# EAGLE schematic Visually impaired v6 panel - v1 (EAGLE 6.5.0)

## Sheet 1 of 4
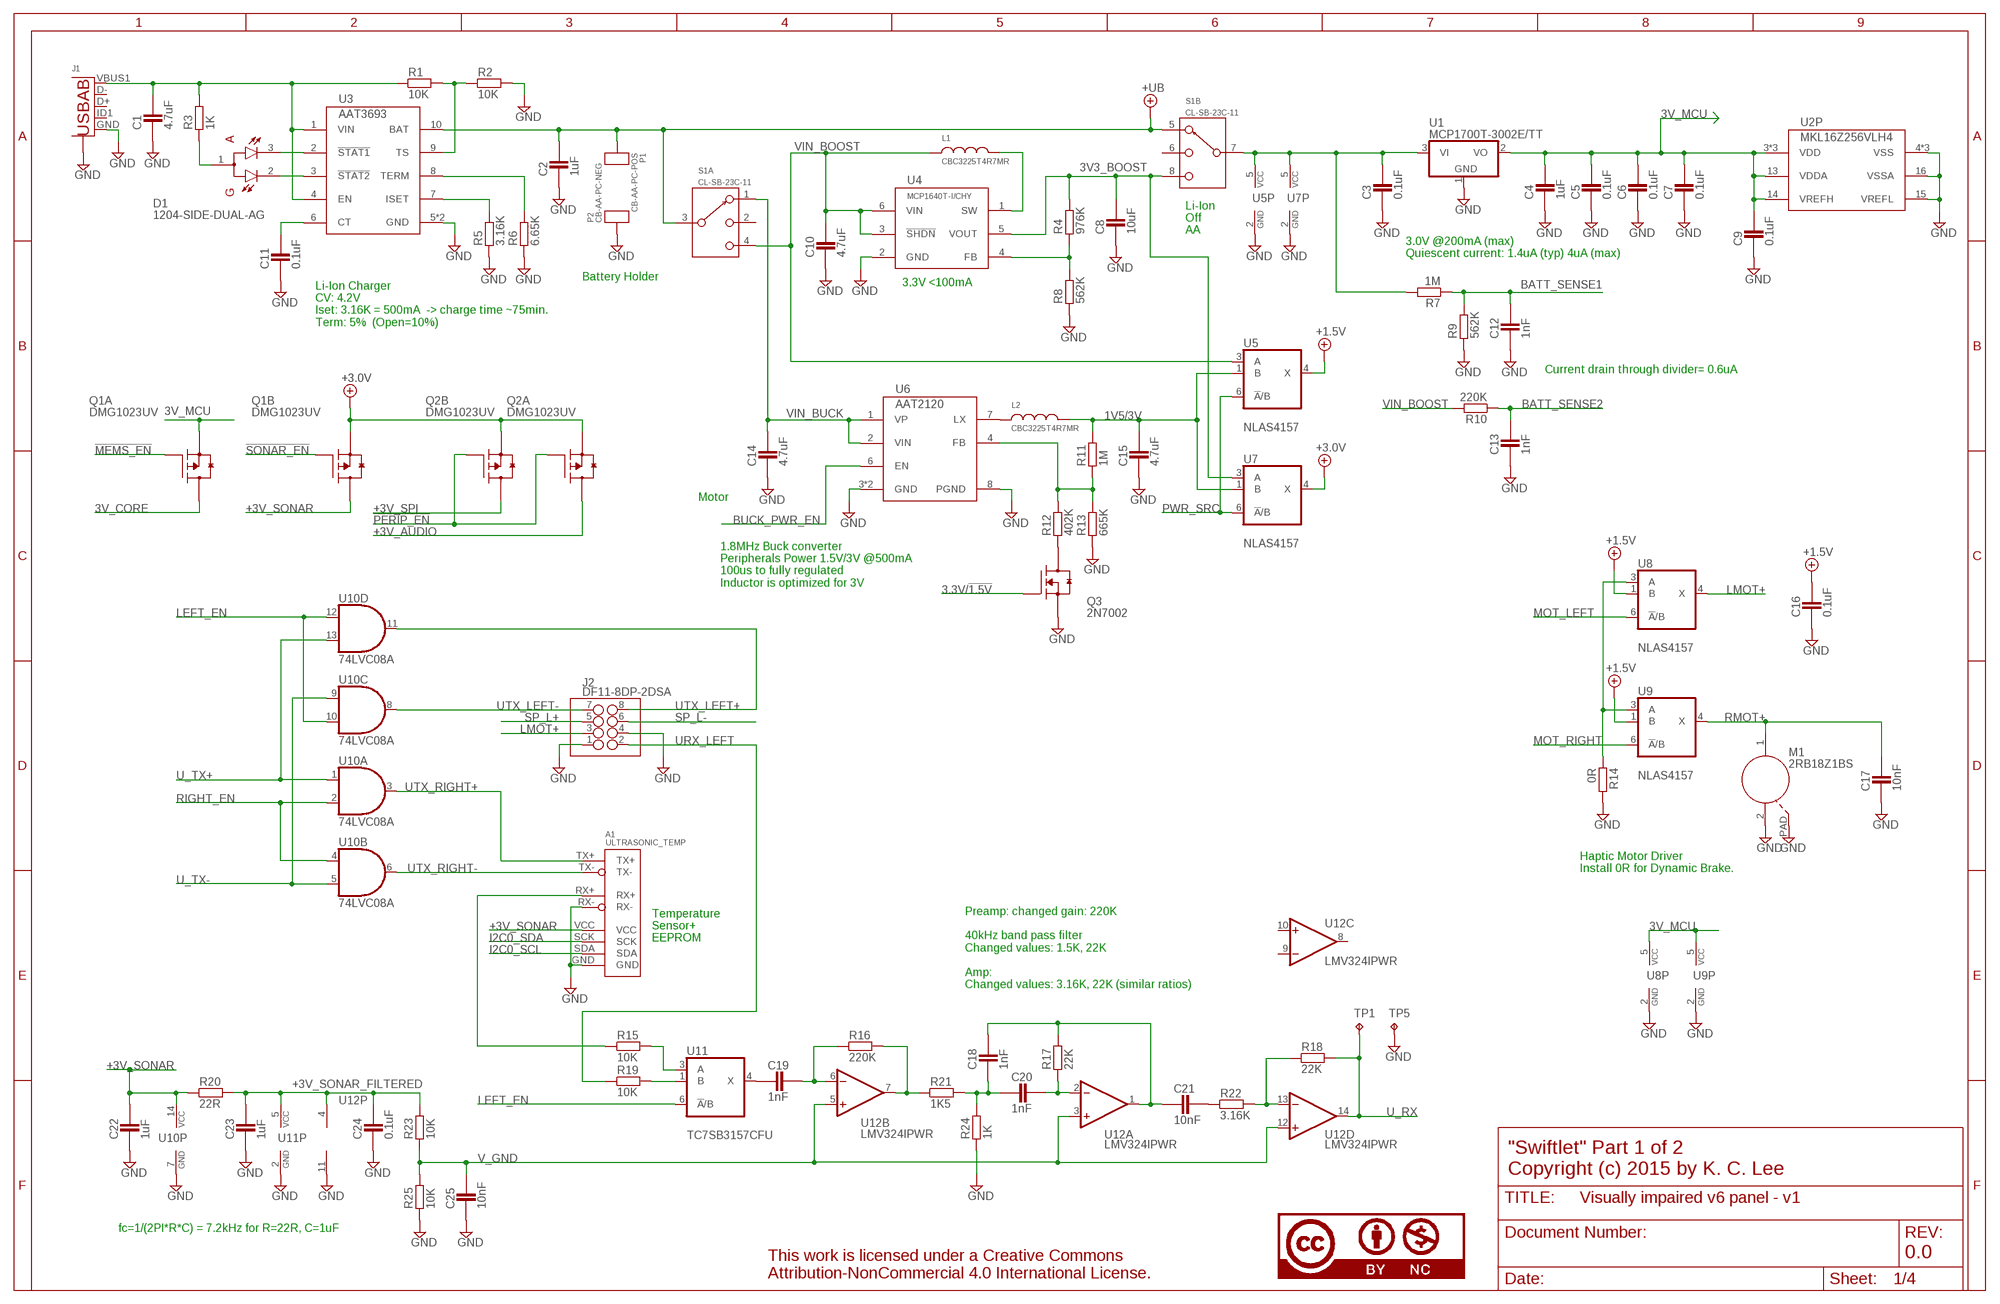
[diagram p0: schematic, sheet 1]

### Parts
A1  ULTRASONIC_TEMP  ULTRASONIC_ASM  [ULTRASONIC_ASM]
C1  4.7uF  CAPACITOR_0603  [CAPC1608X92N]
C2  1uF  CAPACITOR_0402  [CAPC1005X60N]
C3  0.1uF  CAPACITOR_0402  [CAPC1005X60N]
C4  1uF  CAPACITOR_0603  [CAPC1608X92N]
C5  0.1uF  CAPACITOR_0402  [CAPC1005X60N]
C6  0.1uF  CAPACITOR_0402  [CAPC1005X60N]
C7  0.1uF  CAPACITOR_0402  [CAPC1005X60N]
C8  10uF  CAPACITOR_0805N  [CAP2012X70N]
C9  0.1uF  CAPACITOR_0402  [CAPC1005X60N]
C10  4.7uF  CAPACITOR_0603  [CAPC1608X92N]
C11  0.1uF  CAPACITOR_0402  [CAPC1005X60N]
C12  1nF  CAPACITOR_0402  [CAPC1005X60N]
C13  1nF  CAPACITOR_0402  [CAPC1005X60N]
C14  4.7uF  CAPACITOR_0603  [CAPC1608X92N]
C15  4.7uF  CAPACITOR_0603  [CAPC1608X92N]
C16  0.1uF  CAPACITOR_0402  [CAPC1005X60N]
C17  10nF  CAPACITOR_0402  [CAPC1005X60N]
C18  1nF  CAPACITOR_0402  [CAPC1005X60N]
C19  1nF  CAPACITOR_0402  [CAPC1005X60N]
C20  1nF  CAPACITOR_0402  [CAPC1005X60N]
C21  10nF  CAPACITOR_0402  [CAPC1005X60N]
C22  1uF  CAPACITOR_0402  [CAPC1005X60N]
C23  1uF  CAPACITOR_0402  [CAPC1005X60N]
C24  0.1uF  CAPACITOR_0402  [CAPC1005X60N]
C25  10nF  CAPACITOR_0402  [CAPC1005X60N]
D1  1204-SIDE-DUAL-AG  [LED_1204]
J1  USB-ABBG  [USB-AB-MICRO-SMD_V03_SF]
J2  DF11-8DP-2DSA  [DF11-8DP-2DSA]
L1  CBC3225T4R7MR  INDUCTOR_1210  [INDC3225X135N]
L2  CBC3225T4R7MR  INDUCTOR_1210  [INDC3225X135N]
M1  2RB18Z1BS  [2RB18Z1BS]
P1  CB-AA-PC-POS  [CB-AA-PC-POS]
P2  CB-AA-PC-NEG  [CB-AA-PC-NEG]
Q1  DMG1023UV  MOSFET-P-DUALDMP3085LSD  [SOT563]
Q2  DMG1023UV  MOSFET-P-DUALDMP3085LSD  [SOT563]
Q3  2N7002  MOSFET-NCH_SOT-23  [SOT95P280X135-3N]
R1  10K  RESISTOR_0402  [RESC1005X40AN]
R2  10K  RESISTOR_0402  [RESC1005X40AN]
R3  1K  RESISTOR_0402  [RESC1005X40AN]
R4  976K  RESISTOR_0402  [RESC1005X40AN]
R5  3.16K  RESISTOR_0402  [RESC1005X40AN]
R6  6.65K  RESISTOR_0402  [RESC1005X40AN]
R7  1M  RESISTOR_0402  [RESC1005X40AN]
R8  562K  RESISTOR_0402  [RESC1005X40AN]
R9  562K  RESISTOR_0402  [RESC1005X40AN]
R10  220K  RESISTOR_0402  [RESC1005X40AN]
R11  1M  RESISTOR_0402  [RESC1005X40AN]
R12  402K  RESISTOR_0402  [RESC1005X40AN]
R13  665K  RESISTOR_0402  [RESC1005X40AN]
R14  0R  RESISTOR_0402  [RESC1005X40AN]
R15  10K  RESISTOR_0402  [RESC1005X40AN]
R16  220K  RESISTOR_0402  [RESC1005X40AN]
R17  22K  RESISTOR_0402  [RESC1005X40AN]
R18  22K  RESISTOR_0402  [RESC1005X40AN]
R19  10K  RESISTOR_0402  [RESC1005X40AN]
R20  22R  RESISTOR_0402  [RESC1005X40AN]
R21  1K5  RESISTOR_0402  [RESC1005X40AN]
R22  3.16K  RESISTOR_0402  [RESC1005X40AN]
R23  10K  RESISTOR_0402  [RESC1005X40AN]
R24  1K  RESISTOR_0402  [RESC1005X40AN]
R25  10K  RESISTOR_0402  [RESC1005X40AN]
S1  CL-SB-23C-11  JS203011AQNAQN  [SW-JS203011AQN]
TP1  TPTP06SQ  [TP06SQ]
TP5  TPTP06SQ  [TP06SQ]
U1  MCP1700T-3002E/TT  MCP1700/TT  [SOT95P280X135-3N]
U2  MKL16Z256VLH4  MKL16Z_LH4  [LQFP64]
U3  AAT3693  [TDFN-10]
U4  MCP1640T-I/CHY  BOOST-MCP1624T-I/CHY  [SOT26]
U5  NLAS4157  741G3157DCKR  [DCK_R-PDSO-G6]
U6  AAT2120  [STDFN22-8]
U7  NLAS4157  741G3157DCKR  [DCK_R-PDSO-G6]
U8  NLAS4157  741G3157DCKR  [DCK_R-PDSO-G6]
U9  NLAS4157  741G3157DCKR  [DCK_R-PDSO-G6]
U10  74LVC08A  7408DB  [TSSOP14]
U11  TC7SB3157CFU  741G3157DCKR  [DCK_R-PDSO-G6]
U12  LMV324IPWR  QUAD_OPAMPPW  [TSSOP14]
U$1  CC100%  [CC-100]

### Nets
1V5/3V: C15.2 L2.2 R11.2 U5.1(B) U7.1(B)
3.3V/!1.5V: Q3.1(G) ; also sheet 2
3V3_BOOST: C8.2 R4.2 S1.8 U4.5(VOUT) U7.3(A)
3V_CORE: Q1.P$6(A:D) ; also sheet 2
3V_MCU: C4.2 C5.2 C6.2 C7.2 C9.2 Q1.P$1(A:S) U1.2(VO) U2.3(P:VDD) U2.13(P:VDDA) U2.14(P:VREFH) U2.30(P:VDD) U2.48(P:VDD) U8.5(VCC) U9.5(VCC) ; also sheet 2
!MEMS_EN: Q1.P$2(A:G) ; also sheet 2
!PERIP_EN: Q2.P$2(A:G) Q2.P$5(B:G) ; also sheet 2
!SONAR_EN: Q1.P$5(B:G) ; also sheet 2
+1.5V: C16.2 U5.4(X) U8.1(B) U9.1(B)
+3.0V: Q1.P$4(B:S) Q2.P$1(A:S) Q2.P$4(B:S) U7.4(X) ; also sheet 2
+3V_AUDIO: Q2.P$6(A:D) ; also sheet 2
+3V_SONAR: A1.VCC C22.2 Q1.P$3(B:D) R20.1 U10.14(P:VCC)
+3V_SONAR_FILTERED: C23.2 C24.2 R20.2 R23.2 U11.5(VCC) U12.4(P:V+)
+3V_SPI: Q2.P$3(B:D) ; also sheet 2
+UB: C2.2 P1.1(P) S1.3(A:S) S1.5 U3.10(BAT)
BATT_SENSE1: C12.2 R7.1 R9.2 ; also sheet 2
BATT_SENSE2: C13.2 R10.1 ; also sheet 2
BUCK_PWR_EN: U6.6(EN) ; also sheet 2
GND: A1.GND A1.RX- C1.1 C2.1 C3.1 C4.1 C5.1 C6.1 C7.1 C8.1 C9.1 C10.1 C11.1 C12.1 C13.1 C14.1 C15.1 C16.1 C17.1 C22.1 C23.1 C24.1 C25.1 J1.GND J1.S1(S) J1.S2(S) J1.S3(S) J1.S4(S) J2.1 J2.4 M1.2 M1.PAD P2.1(P) P2.2(P) Q3.2(S) R2.2 R5.1 R6.1 R8.1 R9.1 R13.1 R14.2 R24.1 R25.1 TP5.TP U1.1(GND) U2.4(P:VSS) U2.15(P:VREFL) U2.16(P:VSSA) U2.31(P:VSS) U2.47(P:VSS) U3.5(GND) U3.EP(GND) U4.2(GND) U5.2(GND) U6.3(GND) U6.8(PGND) U6.PAD(GND) U7.2(GND) U8.2(GND) U9.2(GND) U10.7(P:GND) U11.2(GND) U12.11(P:V-) ; also sheet 2,3,4
I2C0_SCL: A1.SDA ; also sheet 2
I2C0_SDA: A1.SCK ; also sheet 2
LEFT_EN: U10.10(C:I1) U10.12(D:I0) U11.6(!A!/B) ; also sheet 2
LMOT+: J2.3 U8.4(X)
MOT_LEFT: U8.6(!A!/B) ; also sheet 2
MOT_RIGHT: U9.6(!A!/B) ; also sheet 2
N$1: A1.RX+ R15.1
N$3: R14.1 U8.3(A) U9.3(A)
N$4: L1.2 U4.1(SW)
N$5: C11.2 U3.6(CT)
N$6: R5.2 U3.7(ISET)
N$7: R6.2 U3.8(TERM)
N$8: D1.1(A) R3.1
N$9: D1.3(C1) U3.2(!STAT1)
N$10: D1.2(C2) U3.3(!STAT2)
N$11: C1.2 J1.VBUS1(VBUS) R1.1 R3.2 U3.1(VIN) U3.4(EN)
N$12: R1.2 R2.1 U3.9(TS)
N$17: C21.2 R22.1
N$18: R19.2 U11.1(B)
N$19: R18.1 R22.2 U12.13(D:-IN)
N$20: C19.2 R16.1 U12.6(B:-IN)
N$21: R16.2 R21.1 U12.7(B:OUT)
N$22: C18.1 C20.1 R21.2 R24.2
N$23: C20.2 R17.1 U12.2(A:-IN)
N$24: R15.2 U11.3(A)
N$29: C19.1 U11.4(X)
N$32: R4.1 R8.2 U4.4(FB)
N$36: L2.1 U6.7(LX)
N$39: R11.1 R12.2 R13.2 U6.4(FB)
N$42: Q3.3(D) R12.1
PWR_SRC: U5.6(!A!/B) U7.6(!A!/B) ; also sheet 2
RIGHT_EN: U10.2(A:I1) U10.4(B:I0) ; also sheet 2
RMOT+: C17.2 M1.1 U9.4(X)
SP_L+: J2.5 ; also sheet 2,4
SP_L-: J2.6 ; also sheet 2,4
U_RX: R18.2 TP1.TP U12.14(D:OUT) ; also sheet 2
U_RX__: C18.2 C21.1 R17.2 U12.1(A:OUT)
U_TX+: U10.1(A:I0) U10.13(D:I1) ; also sheet 2
U_TX-: U10.5(B:I1) U10.9(C:I0) ; also sheet 2
URX_LEFT: J2.2 R19.1
UTX_LEFT+: J2.8 U10.11(D:O)
UTX_LEFT-: J2.7 U10.8(C:O)
UTX_RIGHT+: A1.TX+ U10.3(A:O)
UTX_RIGHT-: A1.TX- U10.6(B:O)
V_GND: C25.2 R23.1 R25.2 U12.3(A:+IN) U12.5(B:+IN) U12.12(D:+IN)
VIN_BOOST: C10.2 L1.1 R10.2 S1.4 U4.3(!SHDN) U4.6(VIN) U5.3(A)
VIN_BUCK: C14.2 S1.1 U6.1(VP) U6.2(VIN)
VIN_MCU: C3.2 R7.2 S1.7(B:S) U1.3(VI) U5.5(VCC) U7.5(VCC)
Unconnected: J1.D+ J1.D- J1.ID1(USBID) S1.2 S1.6 U12.8(C:OUT) U12.9(C:-IN) U12.10(C:+IN)

### Notes on the sheet
- Li-Ion
  Off
  AA
- 3.0V @200mA (max)
  Quiescent current: 1.4uA (typ) 4uA (max)
- Battery Holder
- 3.3V <100mA
- Li-Ion Charger
  CV: 4.2V
  Iset: 3.16K = 500mA  -> charge time ~75min.
  Term: 5%  (Open=10%)
- Current drain through divider= 0.6uA
- Motor
- 1.8MHz Buck converter
  Peripherals Power 1.5V/3V @500mA
  100us to fully regulated
  Inductor is optimized for 3V
- Haptic Motor Driver
  Install 0R for Dynamic Brake.
- Temperature 
  Sensor+ 
  EEPROM
- Preamp: changed gain: 220K
  
  40kHz band pass filter
  Changed values: 1.5K, 22K
  
  Amp:
  Changed values: 3.16K, 22K (similar ratios)
- "Swiftlet" Part 1 of 2
  Copyright (c) 2015 by K. C. Lee
- fc=1/(2PI*R*C) = 7.2kHz for R=22R, C=1uF
- 0.0

## Sheet 2 of 4
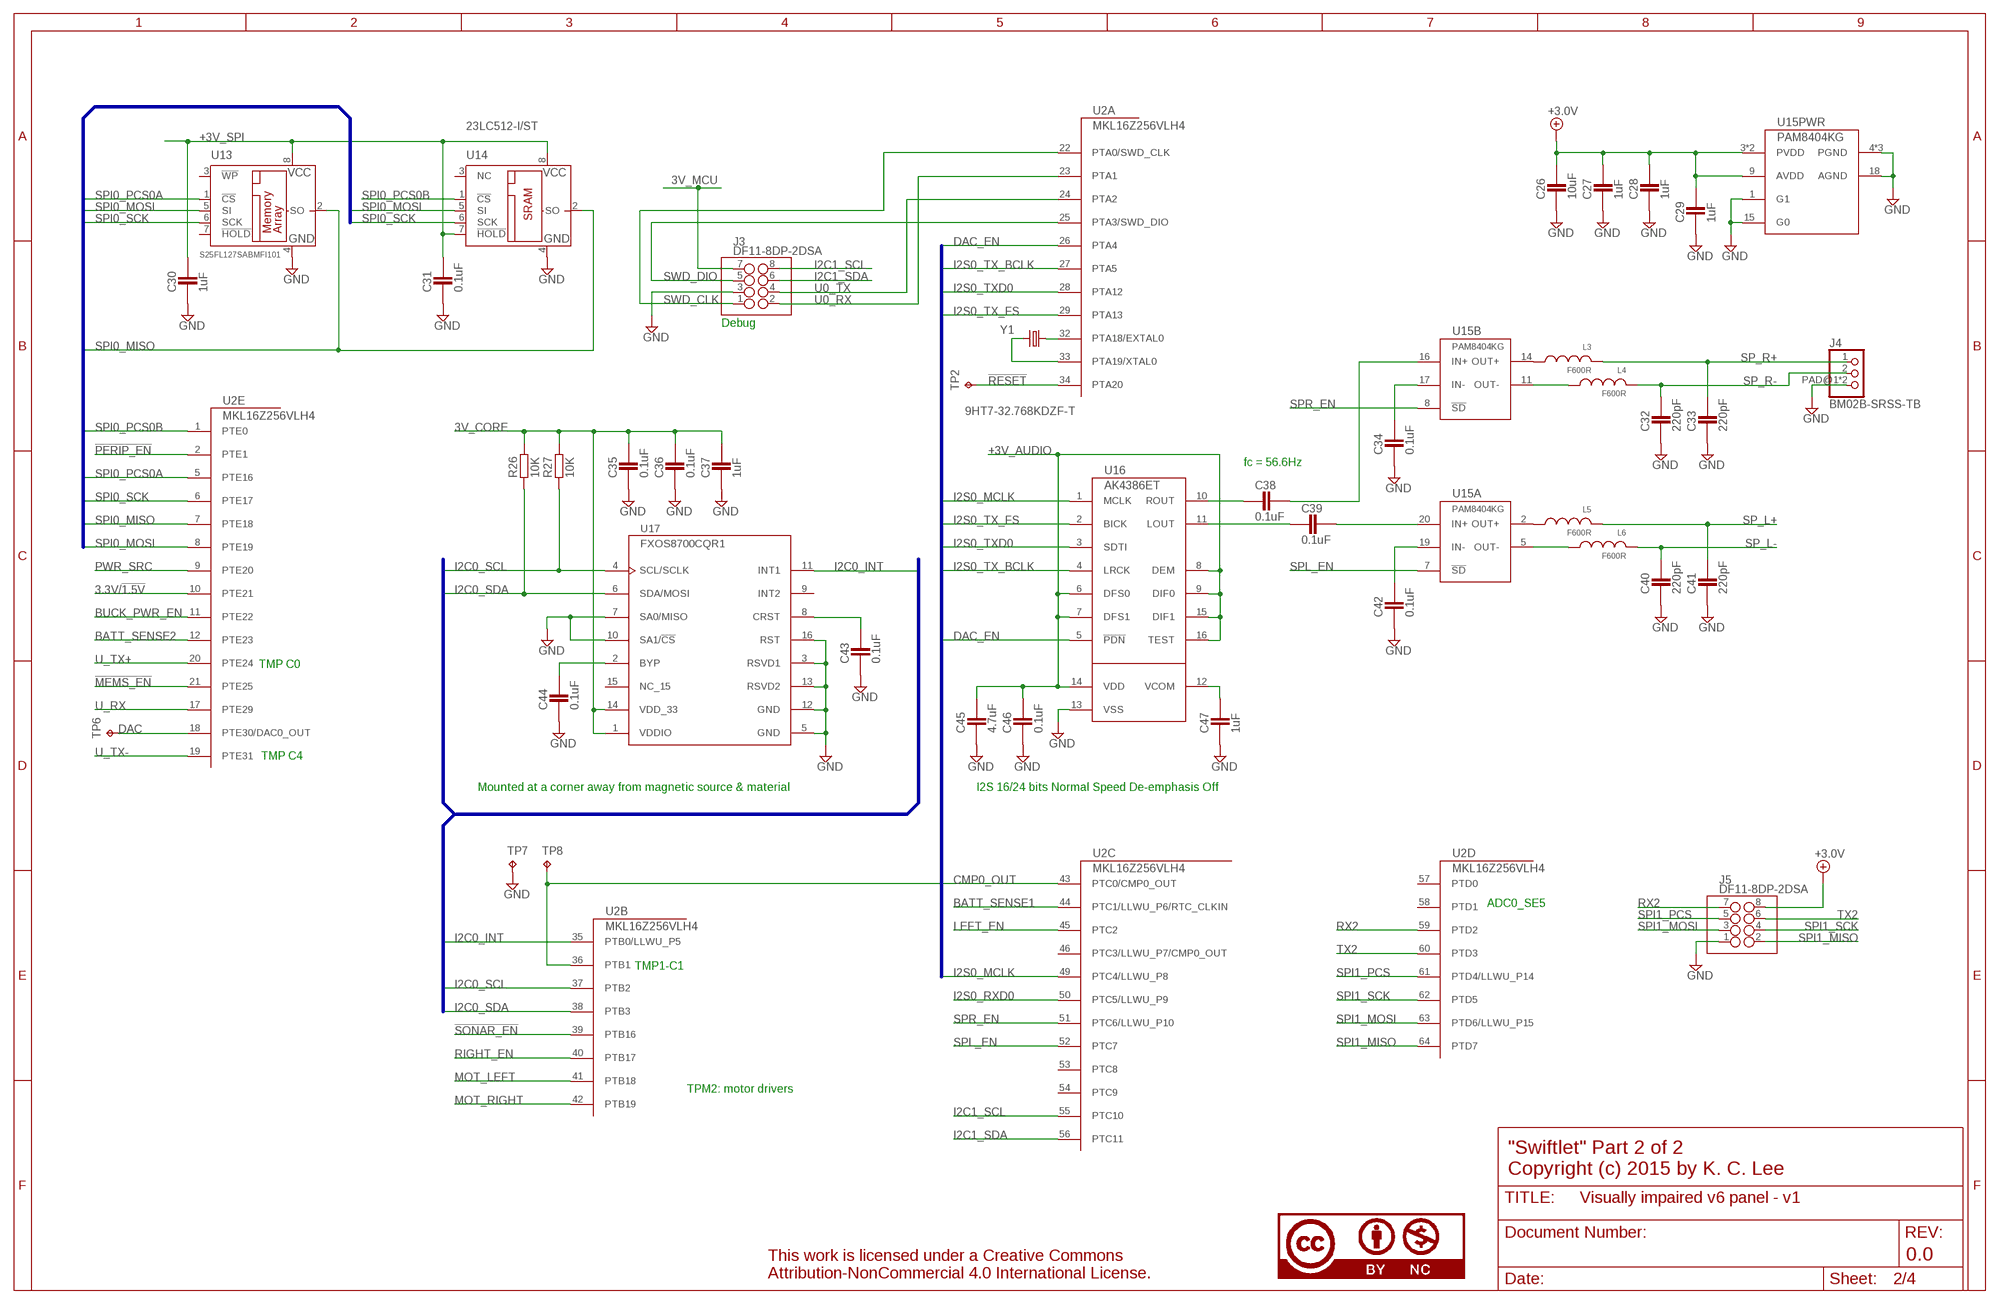
[diagram p1: schematic, sheet 2]

### Parts
C26  10uF  CAPACITOR_0805N  [CAP2012X70N]
C27  1uF  CAPACITOR_0402  [CAPC1005X60N]
C28  1uF  CAPACITOR_0402  [CAPC1005X60N]
C29  1uF  CAPACITOR_0402  [CAPC1005X60N]
C30  1uF  CAPACITOR_0402  [CAPC1005X60N]
C31  0.1uF  CAPACITOR_0402  [CAPC1005X60N]
C32  220pF  CAPACITOR_0402  [CAPC1005X60N]
C33  220pF  CAPACITOR_0402  [CAPC1005X60N]
C34  0.1uF  CAPACITOR_0402  [CAPC1005X60N]
C35  0.1uF  CAPACITOR_0402  [CAPC1005X60N]
C36  0.1uF  CAPACITOR_0402  [CAPC1005X60N]
C37  1uF  CAPACITOR_0402  [CAPC1005X60N]
C38  0.1uF  CAPACITOR_0402  [CAPC1005X60N]
C39  0.1uF  CAPACITOR_0402  [CAPC1005X60N]
C40  220pF  CAPACITOR_0402  [CAPC1005X60N]
C41  220pF  CAPACITOR_0402  [CAPC1005X60N]
C42  0.1uF  CAPACITOR_0402  [CAPC1005X60N]
C43  0.1uF  CAPACITOR_0402  [CAPC1005X60N]
C44  0.1uF  CAPACITOR_0402  [CAPC1005X60N]
C45  4.7uF  CAPACITOR_0603  [CAPC1608X92N]
C46  0.1uF  CAPACITOR_0402  [CAPC1005X60N]
C47  1uF  CAPACITOR_0402  [CAPC1005X60N]
J3  DF11-8DP-2DSA  [DF11-8DP-2DSA]
J4  BM02B-SRSS-TB  [BM02B-SRSS-TB]
J5  DF11-8DP-2DSA  [DF11-8DP-2DSA]
L3  F600R  INDUCTOR_0402  [INDC1005X60N]
L4  F600R  INDUCTOR_0402  [INDC1005X60N]
L5  F600R  INDUCTOR_0402  [INDC1005X60N]
L6  F600R  INDUCTOR_0402  [INDC1005X60N]
R26  10K  RESISTOR_0402  [RESC1005X40AN]
R27  10K  RESISTOR_0402  [RESC1005X40AN]
TP2  TPTP06SQ  [TP06SQ]
TP6  TPTP06SQ  [TP06SQ]
TP7  TPTP06SQ  [TP06SQ]
TP8  TPTP06SQ  [TP06SQ]
U13  S25FL127SABMFI101  25F  [S0C008]
U14  23LC512-I/ST  23K640ST  [TSSOP8]
U15  PAM8404KG  [QFN4040-20]
U16  AK4386ET  AK4386  [TSSOP16]
U17  FXOS8700CQR1  FXOS870CQ  [QFN16_0P5_3X3]
U$3  CC100%  [CC-100]
Y1  9HT7-32.768KDZF-T  XTAL_9HT4  [9HT7]

### Nets
3.3V/!1.5V: U2.10(E:PTE21) ; also sheet 1
3V_CORE: C35.2 C36.2 C37.2 R26.2 R27.2 U17.1(VDDIO) U17.14(VDD_33) ; also sheet 1
3V_MCU: J3.7 ; also sheet 1
!MEMS_EN: U2.21(E:PTE25) ; also sheet 1
!PERIP_EN: U2.2(E:PTE1) ; also sheet 1
!RESET: TP2.TP U2.34(A:PTA20)
!SONAR_EN: U2.39(B:PTB16) ; also sheet 1
+3.0V: C26.2 C27.2 C28.2 C29.2 J5.8 U15.3(PWR:PVDD) U15.9(PWR:AVDD) U15.13(PWR:PVDD) ; also sheet 1
+3V_AUDIO: C45.2 C46.2 U16.6(DFS0) U16.7(DFS1) U16.8(DEM) U16.9(DIF0) U16.14(VDD) U16.15(DIF1) U16.16(TEST) ; also sheet 1
+3V_SPI: C30.2 C31.2 U13.8(VCC) U14.7(!HOLD) U14.8(VCC) ; also sheet 1
BATT_SENSE1: U2.44(C:PTC1/LLWU_P6/RTC_CLKIN) ; also sheet 1
BATT_SENSE2: U2.12(E:PTE23) ; also sheet 1
BUCK_PWR_EN: U2.11(E:PTE22) ; also sheet 1
BYP: C44.2 U17.2(BYP)
CMP0_OUT: TP8.TP U2.36(B:PTB1) U2.43(C:PTC0/CMP0_OUT)
CRST: C43.2 U17.8(CRST)
DAC: TP6.TP U2.18(E:PTE30/DAC0_OUT)
DAC_EN: U2.26(A:PTA4) U16.5(!PDN)
GND: C26.1 C27.1 C28.1 C29.1 C30.1 C31.1 C32.1 C33.1 C34.1 C35.1 C36.1 C37.1 C40.1 C41.1 C42.1 C43.1 C44.1 C45.1 C46.1 C47.1 J3.3 J4.PAD@1 J4.PAD@2 J5.1 TP7.TP U13.4(GND) U14.4(GND) U15.1(PWR:G1) U15.4(PWR:PGND) U15.12(PWR:PGND) U15.15(PWR:G0) U15.18(PWR:AGND) U15.PAD(PWR:PGND) U16.13(VSS) U17.3(RSVD1) U17.5(GND) U17.7(SA0/MISO) U17.10(SA1/!CS) U17.12(GND) U17.13(RSVD2) U17.16(RST) ; also sheet 1,3,4
I2C0_INT: U2.35(B:PTB0/LLWU_P5) U17.11(INT1)
I2C0_SCL: R27.1 U2.37(B:PTB2) U17.4(SCL/SCLK) ; also sheet 1
I2C0_SDA: R26.1 U2.38(B:PTB3) U17.6(SDA/MOSI) ; also sheet 1
I2C1_SCL: J3.8 U2.55(C:PTC10)
I2C1_SDA: J3.6 U2.56(C:PTC11)
I2S0_MCLK: U2.49(C:PTC4/LLWU_P8) U16.1(MCLK)
I2S0_RXD0: U2.50(C:PTC5/LLWU_P9)
I2S0_TX_BCLK: U2.27(A:PTA5) U16.4(LRCK)
I2S0_TX_FS: U2.29(A:PTA13) U16.2(BICK)
I2S0_TXD0: U2.28(A:PTA12) U16.3(SDTI)
LEFT_EN: U2.45(C:PTC2) ; also sheet 1
MOT_LEFT: U2.41(B:PTB18) ; also sheet 1
MOT_RIGHT: U2.42(B:PTB19) ; also sheet 1
N$14: U2.32(A:PTA18/EXTAL0) Y1.1
N$15: U2.33(A:PTA19/XTAL0) Y1.4
N$26: C34.2 U15.17(B:IN-)
N$27: C47.2 U16.12(VCOM)
N$28: C42.2 U15.19(A:IN-)
N$30: C38.1 U16.10(ROUT)
N$31: C38.2 U15.16(B:IN+)
N$33: C39.1 U16.11(LOUT)
N$35: C39.2 U15.20(A:IN+)
N$40: L3.2 U15.14(B:OUT+)
N$41: L4.2 U15.11(B:OUT-)
N$43: L5.2 U15.2(A:OUT+)
N$44: L6.2 U15.5(A:OUT-)
PWR_SRC: U2.9(E:PTE20) ; also sheet 1
RIGHT_EN: U2.40(B:PTB17) ; also sheet 1
RX2: J5.7 U2.59(D:PTD2)
SP_L+: C41.2 L5.1 ; also sheet 1,4
SP_L-: C40.2 L6.1 ; also sheet 1,4
SP_R+: C33.2 J4.1 L3.1
SP_R-: C32.2 J4.2 L4.1
SPI0_MISO: U2.7(E:PTE18) U13.2(SO) U14.2(SO)
SPI0_MOSI: U2.8(E:PTE19) U13.5(SI) U14.5(SI)
SPI0_PCS0A: U2.5(E:PTE16) U13.1(!CS)
SPI0_PCS0B: U2.1(E:PTE0) U14.1(!CS)
SPI0_SCK: U2.6(E:PTE17) U13.6(SCK) U14.6(SCK)
SPI1_MISO: J5.2 U2.64(D:PTD7)
SPI1_MOSI: J5.3 U2.63(D:PTD6/LLWU_P15)
SPI1_PCS: J5.5 U2.61(D:PTD4/LLWU_P14)
SPI1_SCK: J5.4 U2.62(D:PTD5)
SPL_EN: U2.52(C:PTC7) U15.7(A:!SD)
SPR_EN: U2.51(C:PTC6/LLWU_P10) U15.8(B:!SD)
SWD_CLK: J3.1 U2.22(A:PTA0/SWD_CLK)
SWD_DIO: J3.5 U2.25(A:PTA3/SWD_DIO)
TX2: J5.6 U2.60(D:PTD3)
U0_RX: J3.2 U2.23(A:PTA1)
U0_TX: J3.4 U2.24(A:PTA2)
U_RX: U2.17(E:PTE29) ; also sheet 1
U_TX+: U2.20(E:PTE24) ; also sheet 1
U_TX-: U2.19(E:PTE31) ; also sheet 1
Unconnected: U2.46(C:PTC3/LLWU_P7/CMP0_OUT) U2.53(C:PTC8) U2.54(C:PTC9) U2.57(D:PTD0) U2.58(D:PTD1) U13.3(!WP) U13.7(!HOLD) U14.3(NC) U17.9(INT2) U17.15(NC_15)

### Buses
B$1
B$2
B$4

### Notes on the sheet
- Debug
- fc = 56.6Hz
- TMP C0
- TMP C4
- Mounted at a corner away from magnetic source & material | I2S 16/24 bits Normal Speed De-emphasis Off
- ADC0_SE5
- TMP1-C1
- TPM2: motor drivers
- "Swiftlet" Part 2 of 2
  Copyright (c) 2015 by K. C. Lee
- 0.0

## Sheet 3 of 4
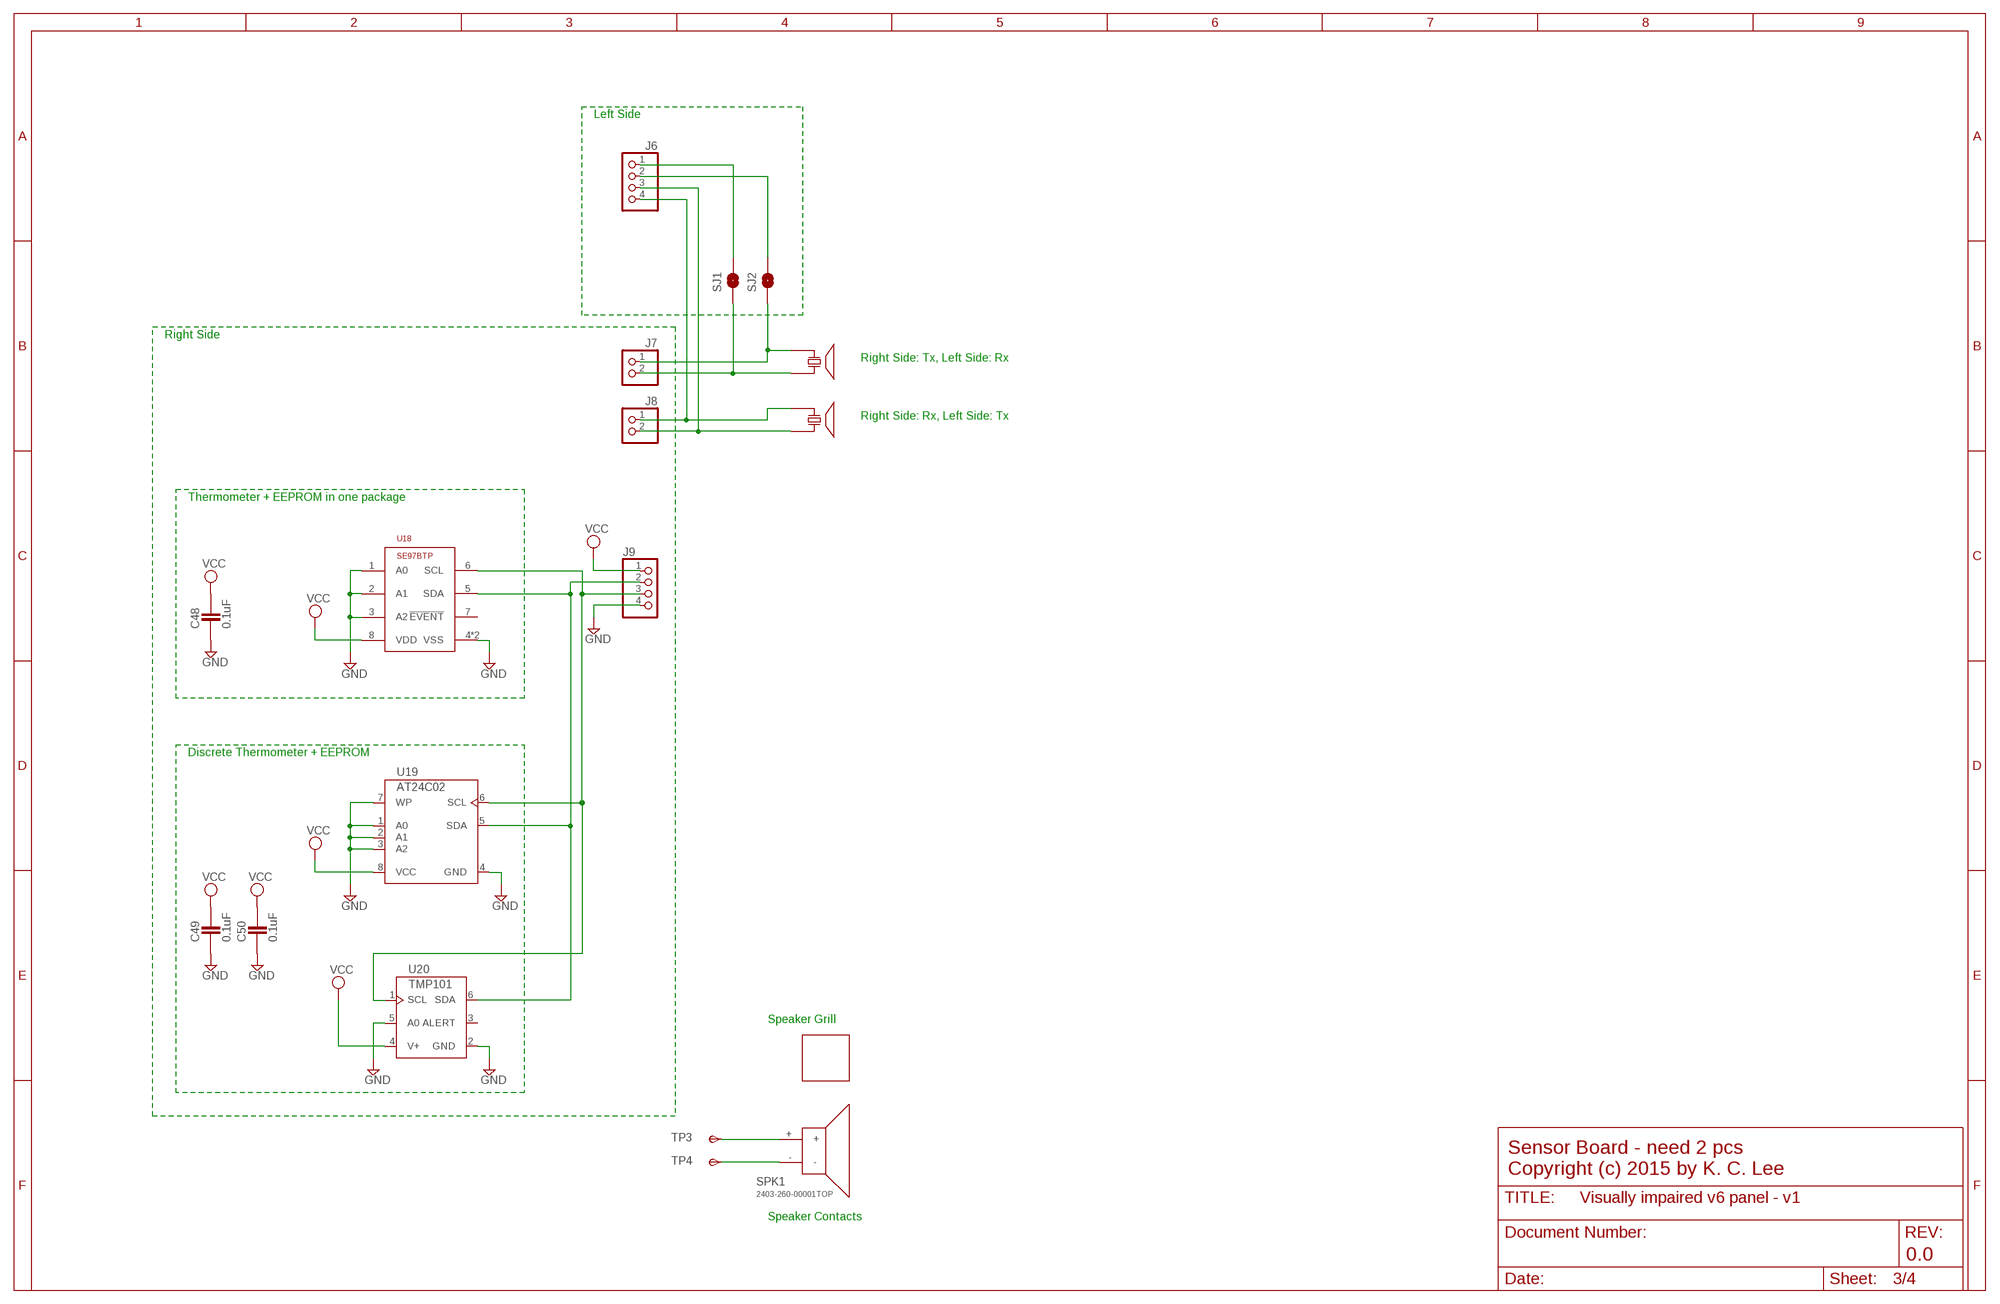
[diagram p2: schematic, sheet 3]

### Parts
C48  0.1uF  CAPACITOR_0402  [CAPC1005X60N]
C49  0.1uF  CAPACITOR_0402  [CAPC1005X60N]
C50  0.1uF  CAPACITOR_0402  [CAPC1005X60N]
GRILL1  2403-260-00001-GRILL  [24030269-00001-GRILL]
J6  PINHD-1X4_2.54_R  [1X04R]
J7  PINHD-1X2_2.54  [1X02]
J8  PINHD-1X2_2.54  [1X02]
J9  PINHD-1X4_2.54_R  [1X04R]
SJ1  SOLDERJUMPERNO  [SJ_2S-NO]
SJ2  SOLDERJUMPERNO  [SJ_2S-NO]
SPK1  2403-260-00001TOP  [2403-269-00001]
T1  TCT40-16T  [TCT40-16]
T2  TCT40-16T  [TCT40-16]
TP3  TPSTP20SQ  [TP20SQ]
TP4  TPSTP20SQ  [TP20SQ]
U18  SE97BTP  [SOT1069-2]
U19  AT24C02  24ST  [TSSOP8]
U20  TMP101  [SOT26]

### Nets
GND: C48.1 C49.1 C50.1 J9.4 U18.1(A0) U18.2(A1) U18.3(A2) U18.4(VSS) U18.PAD(VSS) U19.1(A0) U19.2(A1) U19.3(A2) U19.4(GND) U19.7(WP) U20.2(GND) U20.5(A0) ; also sheet 1,2,4
N$2: J6.2 SJ2.2
N$13: J7.2 SJ1.1 T1.P$2
N$16: J9.2 U18.5(SDA) U19.5(SDA) U20.6(SDA)
N$25: J9.3 U18.6(SCL) U19.6(SCL) U20.1(SCL)
N$34: J6.4 J8.1 T2.P$1
N$37: J6.3 J8.2 T2.P$2
N$38: J6.1 SJ1.2
N$45: J7.1 SJ2.1 T1.P$1
N$51: SPK1.+ TP3.TP(PP)
N$52: SPK1.- TP4.TP(PP)
VCC: C48.2 C49.2 C50.2 J9.1 U18.8(VDD) U19.8(VCC) U20.4(V+)
Unconnected: U18.7(!EVENT) U20.3(ALERT)

### Notes on the sheet
- Left Side
- Right Side
- Right Side: Tx, Left Side: Rx
- Right Side: Rx, Left Side: Tx
- Thermometer + EEPROM in one package
- Discrete Thermometer + EEPROM
- Speaker Grill
- Sensor Board - need 2 pcs
  Copyright (c) 2015 by K. C. Lee
- Speaker Contacts
- 0.0

## Sheet 4 of 4
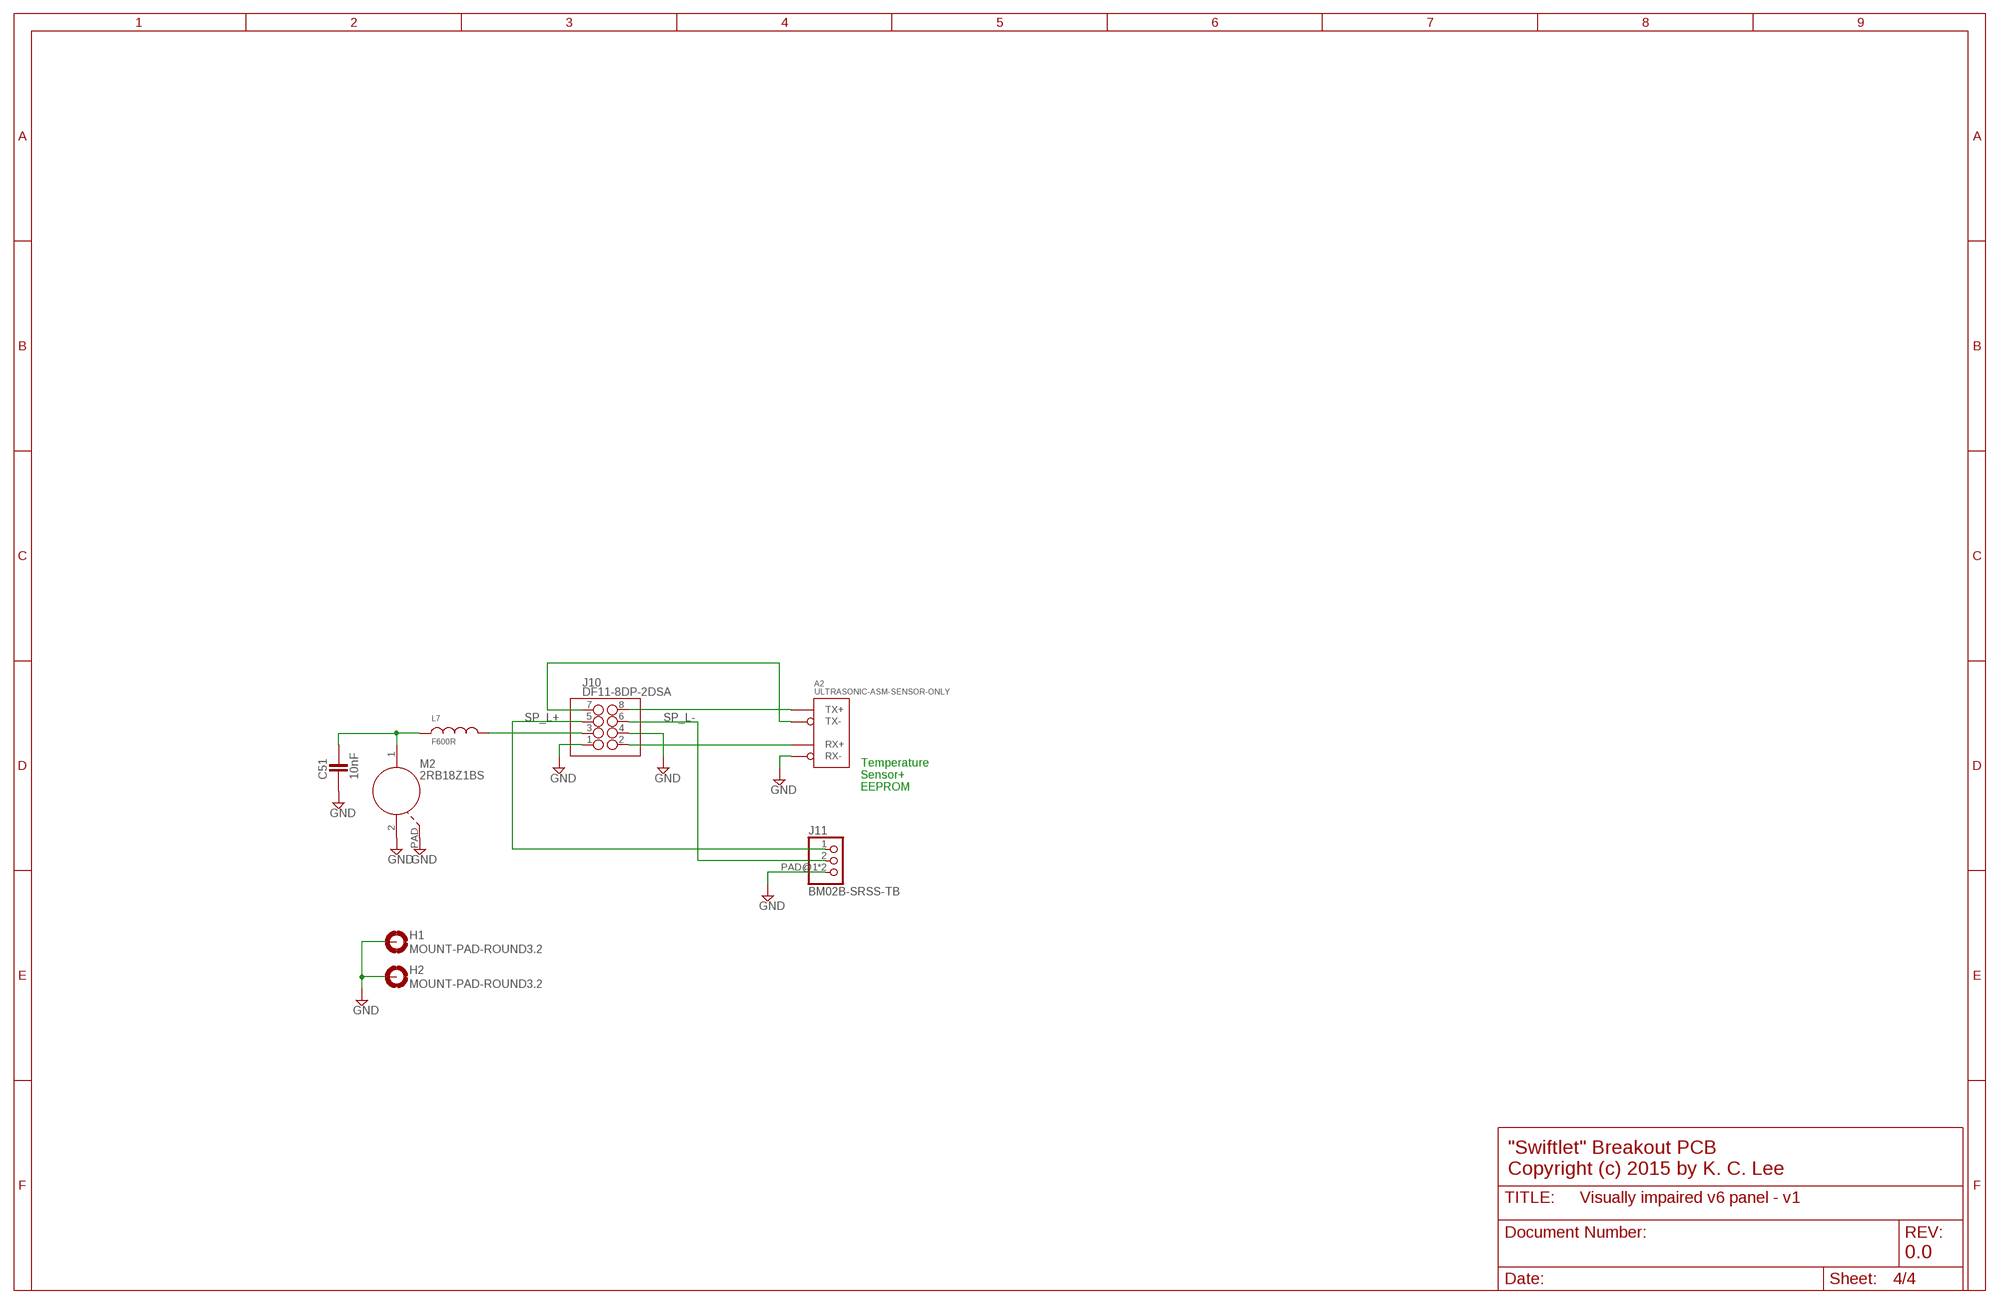
[diagram p3: schematic, sheet 4]

### Parts
A2  ULTRASONIC-ASM-SENSOR-ONLY  [ULTRASONIC-SENSOR-ONLY]
C51  10nF  CAPACITOR_0402  [CAPC1005X60N]
H1  MOUNT-PAD-ROUND3.2  [3,2-PAD]
H2  MOUNT-PAD-ROUND3.2  [3,2-PAD]
J10  DF11-8DP-2DSA  [DF11-8DP-2DSA]
J11  BM02B-SRSS-TB  [BM02B-SRSS-TB]
L7  F600R  INDUCTOR_0402  [INDC1005X60N]
M2  2RB18Z1BS  [2RB18Z1BS]

### Nets
GND: A2.TX+(RX-) C51.1 H1.B3,2(MOUNT) H2.B3,2(MOUNT) J10.1 J10.4 J11.PAD@1 J11.PAD@2 M2.2 M2.PAD ; also sheet 1,2,3
LMOT+1: C51.2 L7.1 M2.1
N$48: A2.RX+(TX-) J10.7
N$49: A2.TX-(RX+) J10.2
N$50: J10.3 L7.2
SP_L+: J10.5 J11.1 ; also sheet 1,2
SP_L-: J10.6 J11.2 ; also sheet 1,2
UTX_RIGHT+1: A2.RX-(TX+) J10.8

### Notes on the sheet
- Temperature 
  Sensor+ 
  EEPROM
- "Swiftlet" Breakout PCB
  Copyright (c) 2015 by K. C. Lee
- 0.0

## Library data of the parts
A1 = Misc Sensors:ULTRASONIC_ASM; PARTNO: *
A2 = Misc Sensors:ULTRASONIC-ASM-SENSOR-ONLY; PARTNO: *
C1 C10 C14 C15 C45 = ipc-7351-capacitor:CAPACITOR_; PARTNO: DK: 1276-2087-1-ND
C2 C22 C23 C27-C30 C37 C47 = ipc-7351-capacitor:CAPACITOR_; PARTNO: DK: 490-10435-1-ND
C3 C5-C7 C9 C11 C16 C24 C31 C34-C36 C38 C39 C42-C44 C46 C48-C50 = ipc-7351-capacitor:CAPACITOR_; PARTNO: STOCK: DK 587-1227-1-ND
C4 = ipc-7351-capacitor:CAPACITOR_; PARTNO: STOCK: 1UF/10V 20% TDK
C8 C26 = ipc-7351-capacitor:CAPACITOR_; PARTNO: DK: 490-10470-1-ND
C12 C13 C18-C20 = ipc-7351-capacitor:CAPACITOR_; PARTNO: DK: 490-6349-1-ND
C17 C21 C25 C51 = ipc-7351-capacitor:CAPACITOR_; PARTNO: DK: 490-1312-1-ND
C32 C33 C40 C41 = ipc-7351-capacitor:CAPACITOR_; PARTNO: DK: 1276-1531-1-ND
D1 = Misc opto:1204-SIDE-DUAL; PARTNO: STOCK
GRILL1 = Misc Sensors:2403-260-00001-GRILL; PARTNO: *
H1 H2 = holes:MOUNT-PAD-ROUND: MOUNTING PAD, round; PARTNO: *
J1 = Misc Conn:USB-AB: This is a USB AB connector that is compatible with USB OTG. i.e. this connector can serve as a host or device; PARTNO: DX: SKU134132
J2 J3 J5 J10 = Misc Conn:DF11-8DP-2DSA; PARTNO: DK: H10231-ND
J4 J11 = Misc Conn:BM02B-SRSS-TB; PARTNO: *
J6 J9 = Misc Conn:PINHD-1X4: PIN HEADER; PARTNO: *
J7 J8 = Misc Conn:PINHD-1X2: PIN HEADER; PARTNO: *
L1 L2 = ipc-7351-inductor:INDUCTOR_; PARTNO: DK: 587-1624-1-ND
L3-L7 = ipc-7351-inductor:INDUCTOR_; PARTNO: DK: 553-2374-1-ND
M1 M2 = Misc Sensors:2RB18Z1BS; PARTNO: ALIEXPRESS
P1 = Misc Conn:CB-AA-PC-; PARTNO: DK: CB-AA-PC-POS-ND
P2 = Misc Conn:CB-AA-PC-; PARTNO: DK: CB-AA-PC-NEG-ND
Q1 Q2 = misc-transistor:MOSFET-P-DUAL; PARTNO: DK: DMG1023UV-7DICT-ND
Q3 = ipc-7351-transistor:MOSFET-NCH_; PARTNO: STOCK
R1 R2 R15 R19 R23 R25-R27 = ipc-7351-resistor:RESISTOR_; PARTNO: DK: 311-10.0KLRCT-ND
R3 R24 = ipc-7351-resistor:RESISTOR_; PARTNO: DK: 311-1.00KLRCT-ND
R4 = ipc-7351-resistor:RESISTOR_; PARTNO: DK: 1276-4289-1-ND
R5 R22 = ipc-7351-resistor:RESISTOR_; PARTNO: DK: 1276-4063-1-ND
R6 = ipc-7351-resistor:RESISTOR_; PARTNO: DK: 1276-4097-1-ND
R7 R11 = ipc-7351-resistor:RESISTOR_; PARTNO: DK: 311-1.00MLRCT-ND
R8 R9 = ipc-7351-resistor:RESISTOR_; PARTNO: DK: 1276-4268-1-ND
R10 R16 = ipc-7351-resistor:RESISTOR_; PARTNO: DK: 311-220KLRCT-ND
R12 = ipc-7351-resistor:RESISTOR_; PARTNO: DK: 1276-4254-1-ND
R13 = ipc-7351-resistor:RESISTOR_; PARTNO: DK: 1276-4275-1-ND
R14 = ipc-7351-resistor:RESISTOR_; PARTNO: DK: 311-0.0JRCT-ND
R17 R18 = ipc-7351-resistor:RESISTOR_; PARTNO: DK: 311-22.0KLRCT-ND
R20 = ipc-7351-resistor:RESISTOR_; PARTNO: DK: 311-22.0LRCT-ND
R21 = ipc-7351-resistor:RESISTOR_; PARTNO: DK: 311-1.50KLRCT-ND
S1 = Misc Passives:JS203011; PARTNO: DK: 563-1360-ND
SJ1 SJ2 = SparkFun-Passives:SOLDERJUMPER: Solder Jumper Standard SMD solder jumper. Used to automate production. Two varients : Normally Open and Normally Closed are the same, but have different paste layers. NC will have a large amount of paste and should jumper during reflow.; PARTNO: *
SPK1 = Misc Sensors:2403-260-00001; PARTNO: *
T1 T2 = Misc Sensors:TCT40-16; PARTNO: *
TP1 TP2 TP5-TP8 = testpad:TP: Test pad; PARTNO: *
TP3 TP4 = testpad:TPS: TEST PIN; PARTNO: *
U1 = Misc Power:MCP1700; PARTNO: STOCK: MCP1700T-3002E/TTCT-ND
U2 = Misc Processor:MKL16Z_LH4; PARTNO: DK: MKL16Z256VLH4-ND
U3 = Misc Power:AAT3693; PARTNO: DK: 863-1512-1-ND
U4 = Misc Power:BOOST-; PARTNO: DK: MCP1640T-I/CHYCT-ND
U5 U7-U9 = 74xx-little-us:74*1G3157: Single-Pole, Double-Throw Analog Switch Source: http://focus.ti.com/lit/ds/symlink/sn74lvc1g3157.pdf; PARTNO: DK: NLAS4157DFT2GOSCT-ND
U6 = Misc Power:AAT2120; PARTNO: DK: 863-1527-1-ND
U10 = Misc Logic:74*08: Quad 2-input AND gate; PARTNO: DK: 296-1221-1-ND
U11 = 74xx-little-us:74*1G3157: Single-Pole, Double-Throw Analog Switch Source: http://focus.ti.com/lit/ds/symlink/sn74lvc1g3157.pdf; PARTNO: DK: TC7SB3157CFULFCT-ND
U12 = Misc Analog:QUAD_OPAMP; PARTNO: DK: LMV324TSG-13DICT-ND
U13 = Misc Memory:25F; PARTNO: STOCK: DK 1274-1045-ND
U14 = Misc Memory:23*: Serial SRAM 64kb/ 256kb , SPI bus [ 23A = 1.7 - 1.95V, 23K = 2.7 - 3.6V ]; PARTNO: DK: 23LC512-I/ST-ND
U15 = Misc Analog:PAM8404; PARTNO: DK: PAM8404KGRDICT-ND
U16 = Misc Analog:AK4386; PARTNO: DK: 974-1010-1-ND
U17 = Misc Sensors:FXOS870CQ; PARTNO: DK: FXOS8700CQR1CT-ND
U18 = Misc Sensors:SE97; PARTNO: *
U19 = Misc Memory:24*; PARTNO: *
U20 = Misc Sensors:TMP101; PARTNO: *
U$1 U$3 = Misc logo:CC; PARTNO: *
Y1 = Misc Clock:XTAL_: kHz RANGE CRYSTAL UNIT LOW PROFILE SMD Source: Epson Toyocom FC-12M.pdf; PARTNO: DK: 887-1860-1-ND